# Altium project Kenworth_Overview_2.PrjPcb (part 3 of 4)

## Sheet Special_Equipment_Cabinet_Overview.SchDoc: <Document>
size Letter; Engineer: <Engineer>; Organization: UPEL; Address1: USU Power Electronics Lab; Address2: USTAR Building 620, RM 118; Address3: 1600 N 620 E; Address4: North Logan, UT 84341; DocumentNumber: 2; Revision: v1; SheetNumber: 2; SheetTotal: 16; ProjectName: <Project>
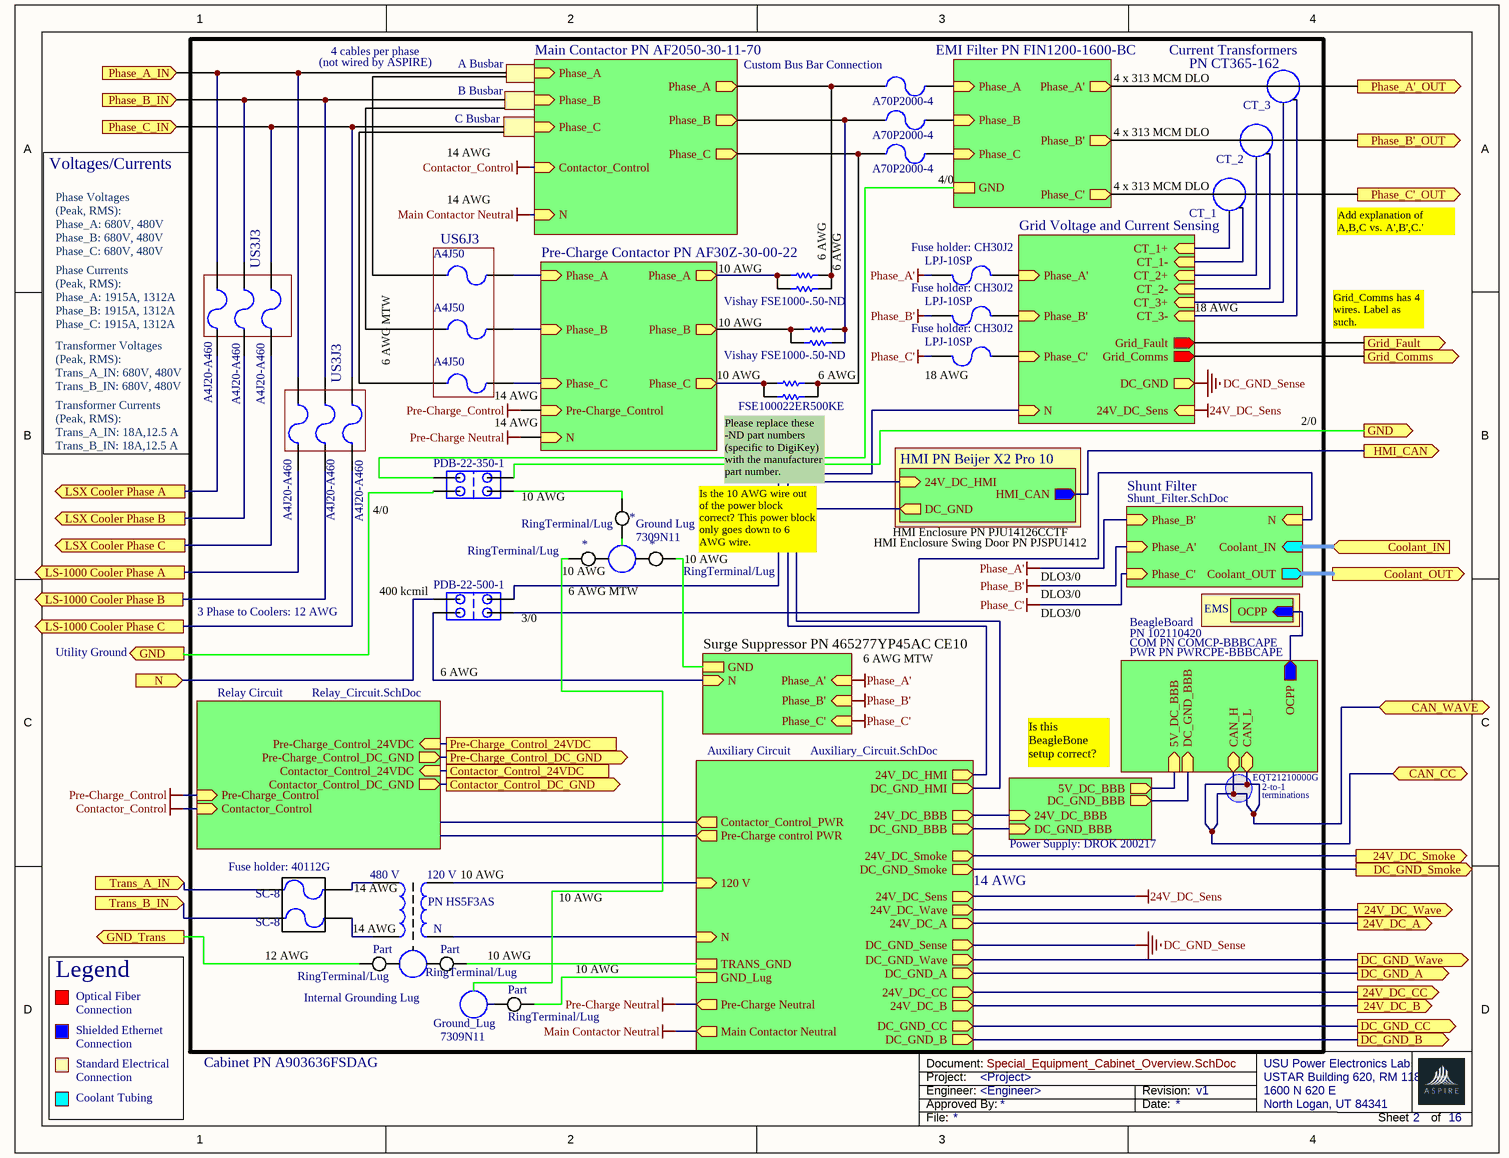
[diagram p9: Special_Equipment_Cabinet_Overview.SchDoc]

### Parts
(Parts that share a designator on the sheet are numbered #1, #2 ... from top to bottom, then left to right.)
7309N11#2  Ground_Lug_Three_Pin  (value not drawn)
7309N11#3  Ground_Lug_Three_Pin  (value not drawn)
7309N11#4  Ground_Lug
*#2  CT_3
*#3  CT_2
*#4  CT_1
*#5  RingTerminal/Lug
*#6  RingTerminal/Lug
*#7  RingTerminal/Lug
F64  A70P2000-4  [PIN-W2/E2.8]
F65  A70P2000-4  [PIN-W2/E2.8]
F66  A70P2000-4  [PIN-W2/E2.8]
F67  A4J50  [PIN-W2/E2.8]
F68  Fuse 2  [PIN-W2/E2.8]  (value not drawn)
F69  A4J50  [PIN-W2/E2.8]
F70  Fuse 2  [PIN-W2/E2.8]  (value not drawn)
F71  A4J50  [PIN-W2/E2.8]
F72  Fuse 2  [PIN-W2/E2.8]  (value not drawn)
F?#1  A4J20-A460  [PIN-W2/E2.8]
F?#2  A4J20-A460  [PIN-W2/E2.8]
F?#3  A4J20-A460  [PIN-W2/E2.8]
F?#4  A4J20-A460  [PIN-W2/E2.8]
F?#5  A4J20-A460  [PIN-W2/E2.8]
F?#6  A4J20-A460  [PIN-W2/E2.8]
FSE100022ER500KE  Res1  [AXIAL-0.3]  (value not drawn)
J16  PDB-22-350-1
J17  PDB-22-500-1
Part#1  RingTerminal/Lug
Part#2  RingTerminal/Lug
Part#3  RingTerminal/Lug
SC-8#1  Fuse 2  [PIN-W2/E2.8]  (value not drawn)
SC-8#2  Fuse 2  [PIN-W2/E2.8]  (value not drawn)
T1  PN HS5F3AS  [TRANS]
Vishay_FSE1  Res1  [AXIAL-0.3]  (value not drawn)
Vishay_FSE2  Res1  [AXIAL-0.3]  (value not drawn)
Vishay_FSE3  Res1  [AXIAL-0.3]  (value not drawn)
Vishay_FSE1000-.50-ND#1  Res1  [AXIAL-0.3]  (value not drawn)
Vishay_FSE1000-.50-ND#2  Res1  [AXIAL-0.3]  (value not drawn)

### Blocks framed on the sheet
US6J3: F67 F69 F71
US3J3: F?#1-F?#3
US3J3: F?#4-F?#6

### Sub-sheets
Auxiliary Circuit = Auxiliary_Circuit.SchDoc: 24V_DC_A (out), DC_GND_B (out), DC_GND_CC (out), 24V_DC_Wave (out), DC_GND_Wave (out), DC_GND_A (out), 24V_DC_CC (out), 24V_DC_B (out), 24V_DC_Sens (out), DC_GND_Sense (out), Pre-Charge Neutral (out), Main Contactor Neutral (out), 120 V (in), N (in), Contactor_Control_PWR (out), Pre-Charge control PWR (out), DC_GND_Smoke (out), 24V_DC_Smoke (out), TRANS_GND, GND_Lug, 24V_DC_HMI (out), DC_GND_HMI (out), 24V_DC_BBB (out), DC_GND_BBB (out)
BeagleBoard = File Name (file not in this document): OCPP (out), CAN_H (bidir), CAN_L (bidir), 5V_DC_BBB (in), DC_GND_BBB (in)
EMI Filter PN FIN1200-1600-BC = File Name (file not in this document): Phase_A (in), Phase_B (in), Phase_C (in), Phase_C' (out), Phase_B' (out), Phase_A' (out), GND
EMS = File Name (file not in this document): OCPP (in)
Grid Voltage and Current Sensing = File Name (file not in this document): Phase_A' (in), Phase_B' (in), Phase_C' (in), N (in), Grid_Comms (out), Grid_Fault (out), 24V_DC_Sens (in), CT_1+ (in), CT_3+ (in), CT_2+ (in), DC_GND (out), CT_1- (in), CT_2- (in), CT_3- (in)
HMI PN Beijer X2 Pro 10 = File Name (file not in this document): 24V_DC_HMI (in), HMI_CAN (out), DC_GND (out)
Main Contactor PN AF2050-30-11-70 = File Name (file not in this document): Phase_A (in), Phase_B (in), Phase_C (in), N (in), Contactor_Control (in), Phase_A (out), Phase_B (out), Phase_C (out)
Power Supply: DROK 200217 = File Name (file not in this document): 5V_DC_BBB (out), DC_GND_BBB (out), 24V_DC_BBB (in), DC_GND_BBB (in)
Pre-Charge Contactor PN AF30Z-30-00-22 = File Name (file not in this document): Phase_B (in), Phase_C (in), Phase_A (out), Phase_B (out), Phase_C (out), Phase_A (in), Pre-Charge_Control (in), N (in)
Relay Circuit = Relay_Circuit.SchDoc: Contactor_Control_24VDC (in), Pre-Charge_Control_DC_GND (out), Pre-Charge_Control (in), Pre-Charge_Control_24VDC (in), Contactor_Control (in), Contactor_Control_DC_GND (out)
Shunt Filter = Shunt_Filter.SchDoc: Phase_B' (in), Phase_A' (in), Phase_C' (in), N (in), Coolant_IN (in), Coolant_OUT (out)
Surge Suppressor PN 465277YP45AC CE10 = File Name (file not in this document): Phase_A' (in), Phase_B' (in), Phase_C' (in), N (in), GND

### Ports
24V_DC_A (out), 24V_DC_B (out), 24V_DC_CC (out), 24V_DC_Smoke (out), 24V_DC_Wave (out), CAN_CC (bidir), CAN_WAVE (bidir), Contactor_Control_24VDC, Contactor_Control_DC_GND (out), Coolant_IN (in), Coolant_OUT (out), DC_GND_A (out), DC_GND_B (out), DC_GND_CC (out), DC_GND_Smoke (out), DC_GND_Wave (out), GND (out), GND_Trans (out), Grid_Comms (out), Grid_Fault (out), HMI_CAN (out), LS-1000 Cooler Phase A (out), LS-1000 Cooler Phase B (out), LS-1000 Cooler Phase C (out), LSX Cooler Phase A (out), LSX Cooler Phase B (out), LSX Cooler Phase C (out), N (in), Phase_A'_OUT (out), Phase_A_IN (in), Phase_B'_OUT (out), Phase_B_IN (in), Phase_C'_OUT (out), Phase_C_IN (in), Pre-Charge_Control_24VDC, Pre-Charge_Control_DC_GND (out), Trans_A_IN (in), Trans_B_IN (in)

### Nets
24V_DC_Sens: sheet Grid Voltage and Current Sensing/24V_DC_Sens, sheet Auxiliary Circuit/24V_DC_Sens
Contactor_Control: sheet Main Contactor PN AF2050-30-11-70/Contactor_Control, sheet Relay Circuit/Contactor_Control
DC_GND_Sense: sheet Grid Voltage and Current Sensing/DC_GND, sheet Auxiliary Circuit/DC_GND_Sense
Main Contactor Neutral: sheet Main Contactor PN AF2050-30-11-70/N, sheet Auxiliary Circuit/Main Contactor Neutral
Phase_A': F68.2 ; sheet Surge Suppressor PN 465277YP45AC CE10/Phase_A', sheet Shunt Filter/Phase_B'
Phase_B': F70.2 ; sheet Surge Suppressor PN 465277YP45AC CE10/Phase_B', sheet Shunt Filter/Phase_A'
Phase_C': F72.2 ; sheet Surge Suppressor PN 465277YP45AC CE10/Phase_C', sheet Shunt Filter/Phase_C'
Pre-Charge Neutral: sheet Pre-Charge Contactor PN AF30Z-30-00-22/N, sheet Auxiliary Circuit/Pre-Charge Neutral
Pre-Charge_Control: sheet Pre-Charge Contactor PN AF30Z-30-00-22/Pre-Charge_Control, sheet Relay Circuit/Pre-Charge_Control
24V_DC_A: port 24V_DC_A, sheet Auxiliary Circuit/24V_DC_A
24V_DC_B: port 24V_DC_B, sheet Auxiliary Circuit/24V_DC_B
24V_DC_CC: port 24V_DC_CC, sheet Auxiliary Circuit/24V_DC_CC
24V_DC_HMI: sheet HMI PN Beijer X2 Pro 10/24V_DC_HMI, sheet Auxiliary Circuit/24V_DC_HMI
24V_DC_Smoke: port 24V_DC_Smoke, sheet Auxiliary Circuit/24V_DC_Smoke
24V_DC_Wave: port 24V_DC_Wave, sheet Auxiliary Circuit/24V_DC_Wave
120 V: T1.3 ; sheet Auxiliary Circuit/120 V
CAN_CC: port CAN_WAVE, port CAN_CC, sheet BeagleBoard/CAN_H, sheet BeagleBoard/CAN_L
Contactor_Control_24VDC: port Contactor_Control_24VDC, sheet Relay Circuit/Contactor_Control_24VDC
Contactor_Control_DC_GND: port Contactor_Control_DC_GND, sheet Relay Circuit/Contactor_Control_DC_GND
Coolant_IN: port Coolant_IN, sheet Shunt Filter/Coolant_IN
Coolant_OUT: port Coolant_OUT, sheet Shunt Filter/Coolant_OUT
DC_GND_A: port DC_GND_A, sheet Auxiliary Circuit/DC_GND_A
DC_GND_B: port DC_GND_B, sheet Auxiliary Circuit/DC_GND_B
DC_GND_CC: port DC_GND_CC, sheet Auxiliary Circuit/DC_GND_CC
DC_GND_HMI: sheet HMI PN Beijer X2 Pro 10/DC_GND, sheet Auxiliary Circuit/DC_GND_HMI
DC_GND_Smoke: port DC_GND_Smoke, sheet Auxiliary Circuit/DC_GND_Smoke
DC_GND_Wave: port DC_GND_Wave, sheet Auxiliary Circuit/DC_GND_Wave
GND: J16.2 J16.4 ; port GND
GND_Trans: Part#1.2_13 ; port GND_Trans
Grid_Comms: port Grid_Comms, sheet Grid Voltage and Current Sensing/Grid_Comms
Grid_Fault: port Grid_Fault, sheet Grid Voltage and Current Sensing/Grid_Fault
HMI_CAN: port HMI_CAN, sheet HMI PN Beijer X2 Pro 10/HMI_CAN
LS-1000 Cooler Phase A: F?#4.1 ; port LS-1000 Cooler Phase A
LS-1000 Cooler Phase B: F?#5.1 ; port LS-1000 Cooler Phase B
LS-1000 Cooler Phase C: F?#6.1 ; port LS-1000 Cooler Phase C
LSX Cooler Phase A: F?#1.1 ; port LSX Cooler Phase A
LSX Cooler Phase B: F?#2.1 ; port LSX Cooler Phase B
LSX Cooler Phase C: F?#3.1 ; port LSX Cooler Phase C
N: T1.4 ; sheet Auxiliary Circuit/N
N: J17.1 ; sheet Shunt Filter/N  [a separate net that carries the same name]
N: J17.4 ; port N  [a separate net that carries the same name]
Phase_A'_OUT: port Phase_A'_OUT, sheet EMI Filter PN FIN1200-1600-BC/Phase_A'
Phase_A_IN: F?#1.2 F?#4.2 ; port Phase_A_IN
Phase_B'_OUT: port Phase_B'_OUT, sheet EMI Filter PN FIN1200-1600-BC/Phase_B'
Phase_B_IN: F?#2.2 F?#5.2 ; port Phase_B_IN
Phase_C'_OUT: port Phase_C'_OUT, sheet EMI Filter PN FIN1200-1600-BC/Phase_C'
Phase_C_IN: F?#3.2 F?#6.2 ; port Phase_C_IN
Pre-Charge_Control_24VDC: port Pre-Charge_Control_24VDC, sheet Relay Circuit/Pre-Charge_Control_24VDC
Pre-Charge_Control_DC_GND: port Pre-Charge_Control_DC_GND, sheet Relay Circuit/Pre-Charge_Control_DC_GND
Trans_A_IN: SC-8#1.1 ; port Trans_A_IN
Trans_B_IN: SC-8#2.1 ; port Trans_B_IN
TRANS_GND: Part#2.2_12 ; sheet Auxiliary Circuit/TRANS_GND
Net7309N11#2_5: 7309N11#2.5 *#5.2_12
Net7309N11#2_5: 7309N11#2.5 *#7.2_13  [a separate net that carries the same name]
Net7309N11#2_5: 7309N11#2.5 *#6.2_12  [a separate net that carries the same name]
Net7309N11#3_5: 7309N11#3.5 Part#2.2_13
Net7309N11#3_5: 7309N11#3.5 Part#1.2_12  [a separate net that carries the same name]
Net7309N11#4_5: 7309N11#4.5 *#6.2_13
Net7309N11#4_5: 7309N11#4.5 Part#3.2_13  [a separate net that carries the same name]
Net*#2_4: *#2.4 ; sheet Grid Voltage and Current Sensing/CT_3+
Net*#2_4: *#2.4 ; sheet Grid Voltage and Current Sensing/CT_3-  [a separate net that carries the same name]
Net*#3_4: *#3.4 ; sheet Grid Voltage and Current Sensing/CT_2+
Net*#3_4: *#3.4 ; sheet Grid Voltage and Current Sensing/CT_2-  [a separate net that carries the same name]
Net*#4_4: *#4.4 ; sheet Grid Voltage and Current Sensing/CT_1+
Net*#4_4: *#4.4 ; sheet Grid Voltage and Current Sensing/CT_1-  [a separate net that carries the same name]
Net*#5_2_13: *#5.2_13 J16.1
Net*#7_2_12: *#7.2_12 ; sheet Surge Suppressor PN 465277YP45AC CE10/GND
NetF64_1: F64.1 Vishay_FSE1.2 Vishay_FSE1000-.50-ND#1.2 ; sheet Main Contactor PN AF2050-30-11-70/Phase_A
NetF64_2: F64.2 ; sheet EMI Filter PN FIN1200-1600-BC/Phase_A
NetF65_1: F65.1 Vishay_FSE2.2 Vishay_FSE1000-.50-ND#2.2 ; sheet Main Contactor PN AF2050-30-11-70/Phase_B
NetF65_2: F65.2 ; sheet EMI Filter PN FIN1200-1600-BC/Phase_B
NetF66_1: F66.1 FSE100022ER500KE.2 Vishay_FSE3.2 ; sheet Main Contactor PN AF2050-30-11-70/Phase_C
NetF66_2: F66.2 ; sheet EMI Filter PN FIN1200-1600-BC/Phase_C
NetF67_2: F67.2 ; sheet Pre-Charge Contactor PN AF30Z-30-00-22/Phase_A
NetF68_1: F68.1 ; sheet Grid Voltage and Current Sensing/Phase_A'
NetF69_2: F69.2 ; sheet Pre-Charge Contactor PN AF30Z-30-00-22/Phase_B
NetF70_1: F70.1 ; sheet Grid Voltage and Current Sensing/Phase_B'
NetF71_2: F71.2 ; sheet Pre-Charge Contactor PN AF30Z-30-00-22/Phase_C
NetF72_1: F72.1 ; sheet Grid Voltage and Current Sensing/Phase_C'
NetFSE100022ER500KE_1: FSE100022ER500KE.1 Vishay_FSE3.1 ; sheet Pre-Charge Contactor PN AF30Z-30-00-22/Phase_C
NetJ16_4: J16.4 ; sheet EMI Filter PN FIN1200-1600-BC/GND
NetJ17_2: J17.2 ; sheet Grid Voltage and Current Sensing/N
NetJ17_4: J17.4 ; sheet Surge Suppressor PN 465277YP45AC CE10/N
NetPart#3_2_12: Part#3.2_12 ; sheet Auxiliary Circuit/GND_Lug
NetSC-8#1_2: SC-8#1.2 T1.1
NetSC-8#2_2: SC-8#2.2 T1.2
NetVishay_FSE1_1: Vishay_FSE1.1 Vishay_FSE1000-.50-ND#1.1 ; sheet Pre-Charge Contactor PN AF30Z-30-00-22/Phase_A
NetVishay_FSE2_1: Vishay_FSE2.1 Vishay_FSE1000-.50-ND#2.1 ; sheet Pre-Charge Contactor PN AF30Z-30-00-22/Phase_B
(unnamed): sheet Auxiliary Circuit/24V_DC_BBB, sheet Power Supply: DROK 200217/24V_DC_BBB
(unnamed): sheet Auxiliary Circuit/DC_GND_BBB, sheet Power Supply: DROK 200217/DC_GND_BBB
(unnamed): sheet BeagleBoard/OCPP, sheet EMS/OCPP
(unnamed): sheet BeagleBoard/5V_DC_BBB, sheet Power Supply: DROK 200217/5V_DC_BBB
(unnamed): sheet BeagleBoard/DC_GND_BBB, sheet Power Supply: DROK 200217/DC_GND_BBB

Not connected (* = marked no-connect by the designer): F67 1; F69 1; F71 1

### Notes on the sheet
- (not wired by ASPIRE)
- 4 cables per phase
- B Busbar
- A Busbar
- (near F64) Custom Bus Bar Connection
- 4 x 313 MCM DLO
- (near *#2) Current Transformers
- (near *#2) PN CT365-162
- 14 AWG
- C Busbar
- (near *#3) 4 x 313 MCM DLO
- Voltages/Currents
- (near F66) 4/0
- (near *#4) 4 x 313 MCM DLO
- Add explanation of A,B,C vs. A',B',C.'
- Phase Voltages
  (Peak, RMS):
  Phase_A: 680V, 480V
  Phase_B: 680V, 480V
  Phase_C: 680V, 480V
- 10 AWG
- (near Vishay_FSE1000-.50-ND#1) 6 AWG
- 6 AWG
- (near F68) Fuse holder: CH30J2
- (near F68) LPJ-10SP
- (near F?#1) Phase Currents
  (Peak, RMS):
  Phase_A: 1915A, 1312A
  Phase_B: 1915A, 1312A
  Phase_C: 1915A, 1312A
- 6 AWG MTW
- (near F70) Fuse holder: CH30J2
- (near F70) LPJ-10SP
- (near F72) LPJ-10SP
- 18 AWG
- Grid_Comms has 4 wires. Label as such.
- (near F?#1) Transformer Voltages
  (Peak, RMS):
  Trans_A_IN: 680V, 480V
  Trans_B_IN: 680V, 480V
- (near F71) 14 AWG
- (near F72) 18 AWG
- 2/0
- Transformer Currents
  (Peak, RMS):
  Trans_A_IN: 18A,12.5 A
  Trans_B_IN: 18A,12.5 A
- (near J16) 10 AWG
- Please replace these -ND part numbers (specific to DigiKey) with the manufacturer part number.
- 4/0
- Ground Lug
- (near *#7) 10 AWG
- Is the 10 AWG wire out of the power block correct? This power block only goes down to 6 AWG wire.
- HMI Enclosure PN PJU14126CCTF
- HMI Enclosure Swing Door PN PJSPU1412
- 3 Phase to Coolers: 12 AWG
- (near J17) 400 kcmil
- (near J17) 3/0
- DLO3/0
- PN 102110420
- Utility Ground
- COM PN COMCP-BBBCAPE
- PWR PN PWRCPE-BBBCAPE
- Is this BeagleBone setup correct?
- EQT21210000G
- 2-to-1
- terminations
- (near SC-8#1) Fuse holder: 40112G
- (near T1) 14 AWG
- (near T1) 480 V
- (near T1) 120 V
- (near T1) 10 AWG
- (near SC-8#2) 12 AWG
- N
- Legend
- Optical Fiber
- Shielded Ethernet
- Connection
- Internal Grounding Lug
- Standard Electrical
- Coolant Tubing
- Cabinet PN A903636FSDAG
- Project:
- Engineer:
- Document:
- Approved By:
- Date:
- Revision:
- File:
- Sheet
- of

### Library data of the parts
*#2-*#4 = CT
F64-F72 F?#1-F?#6 SC-8#1 SC-8#2 = Fuse 2: Fuse; Published: 8-Jun-2000; LatestRevisionDate: 17-Jul-2002; LatestRevisionNote: Re-released for DXP Platform.; PackageReference: PIN-W2/E2.8; Publisher: Altium Limited; PackageDescription: Thru-Hole; 2 Leads
FSE100022ER500KE Vishay_FSE1 Vishay_FSE2 Vishay_FSE1000-.50-ND#1 Vishay_FSE1000-.50-ND#2 = Res1: Resistor; Value: 1K; Published: 8-Jun-2000; LatestRevisionDate: 17-Jul-2002; LatestRevisionNote: Re-released for DXP Platform.; PackageReference: AXIAL-0.3; Publisher: Altium Limited; PackageDescription: Axial Device, Thru-Hole; 2 Leads; 0.3 in Pin Spacing
J17 = PDB-22-350-1
T1 = Trans: Transformer; Published: 24-Mar-1999; LatestRevisionDate: 08-Jul-2005; LatestRevisionNote: Mech Layer 1 removed.; PackageReference: TRANS; Publisher: Altium Limited; PackageDescription: Transformer; 4 Leads
Vishay_FSE3 = Res1: Resistor; Value: 1K; MFN: FSE100022ER500KE; Published: 8-Jun-2000; LatestRevisionDate: 17-Jul-2002; LatestRevisionNote: Re-released for DXP Platform.; PackageReference: AXIAL-0.3; Publisher: Altium Limited; PackageDescription: Axial Device, Thru-Hole; 2 Leads; 0.3 in Pin Spacing

## Sheet Shunt_Filter.SchDoc: <Document>
size Letter; Engineer: <Engineer>; Organization: UPEL; Address1: USU Power Electronics Lab; Address2: USTAR Building 620, RM 118; Address3: 1600 N 620 E; Address4: North Logan, UT 84341; DocumentNumber: 3; Revision: v1; SheetNumber: 3; SheetTotal: 16; ProjectName: <Project>
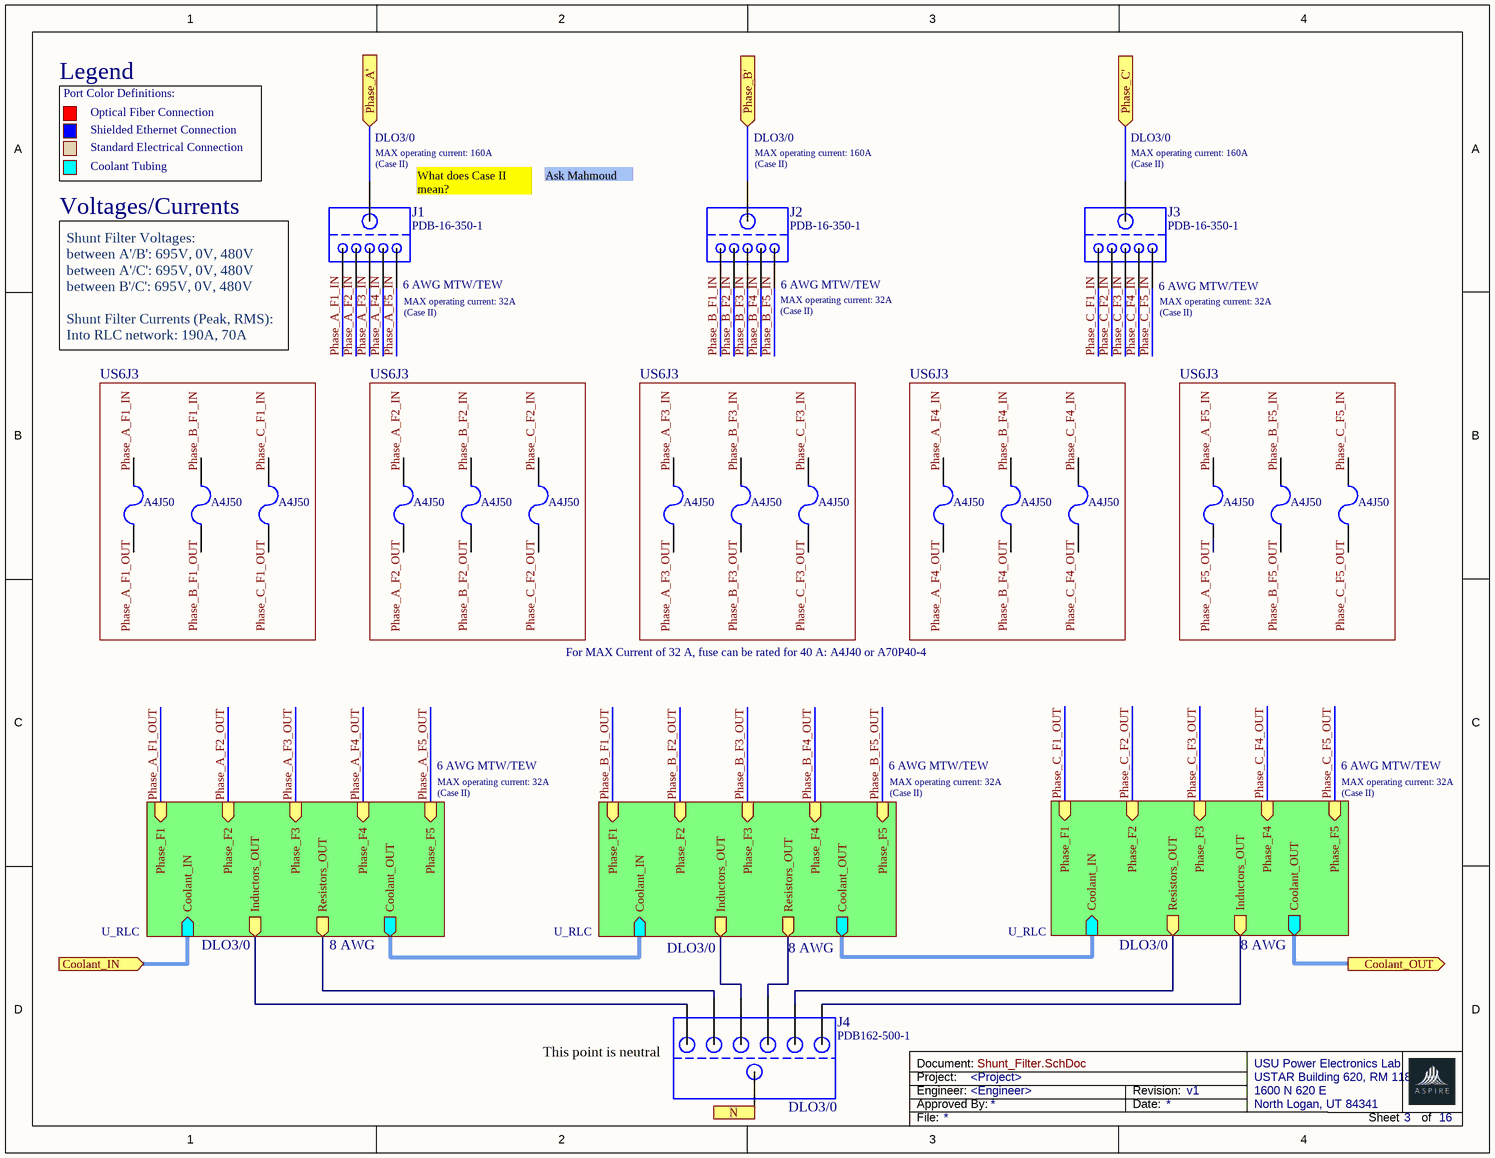
[diagram p10: Shunt_Filter.SchDoc]

### Parts
F1  A4J50  [PIN-W2/E2.8]
F2  A4J50  [PIN-W2/E2.8]
F3  A4J50  [PIN-W2/E2.8]
F4  A4J50  [PIN-W2/E2.8]
F5  A4J50  [PIN-W2/E2.8]
F7  A4J50  [PIN-W2/E2.8]
F8  A4J50  [PIN-W2/E2.8]
F9  A4J50  [PIN-W2/E2.8]
F10  A4J50  [PIN-W2/E2.8]
F11  A4J50  [PIN-W2/E2.8]
F12  A4J50  [PIN-W2/E2.8]
F13  A4J50  [PIN-W2/E2.8]
F14  A4J50  [PIN-W2/E2.8]
F15  A4J50  [PIN-W2/E2.8]
F16  A4J50  [PIN-W2/E2.8]
J1  PDB-16-350-1
J2  PDB-16-350-1
J3  PDB-16-350-1
J4  PDB162-500-1

### Blocks framed on the sheet
US6J3: F1-F3
US6J3: F4 F5 F7
US6J3: F8-F10
US6J3: F11-F13
US6J3: F14-F16

### Sub-sheets
U_RLC = RLC.SchDoc: Phase_F1 (in), Phase_F2 (in), Phase_F3 (in), Phase_F4 (in), Phase_F5 (in), Inductors_OUT (out), Resistors_OUT (out), Coolant_IN (in), Coolant_OUT (out)
U_RLC = RLC.SchDoc: Phase_F1 (in), Phase_F2 (in), Phase_F3 (in), Phase_F4 (in), Phase_F5 (in), Resistors_OUT (out), Inductors_OUT (out), Coolant_IN (in), Coolant_OUT (out)
U_RLC = RLC.SchDoc: Phase_F1 (in), Phase_F2 (in), Phase_F3 (in), Phase_F4 (in), Phase_F5 (in), Resistors_OUT (out), Inductors_OUT (out), Coolant_OUT (out), Coolant_IN (in)

### Ports
Coolant_IN (in), Coolant_OUT (out), N (in), Phase_A' (in), Phase_B' (in), Phase_C' (in)

### Nets
Phase_A': J2.0 ; port Phase_B'
Phase_B': J1.0 ; port Phase_A'
Phase_C': J3.0 ; port Phase_C'
Coolant_IN: port Coolant_IN, sheet U_RLC/Coolant_IN
Coolant_IN_U_RLC: sheet U_RLC/Coolant_OUT, sheet U_RLC/Coolant_IN
Coolant_IN_U_RLC: sheet U_RLC/Coolant_OUT, sheet U_RLC/Coolant_IN  [a separate net that carries the same name]
Coolant_OUT: port Coolant_OUT, sheet U_RLC/Coolant_OUT
Inductors_OUT: J4.0 ; sheet U_RLC/Inductors_OUT
Inductors_OUT: J4.0 ; sheet U_RLC/Inductors_OUT  [a separate net that carries the same name]
Inductors_OUT: J4.0 ; sheet U_RLC/Inductors_OUT  [a separate net that carries the same name]
N: J4.0 ; port N
Phase_A_F1_IN: J1.1
Phase_A_F2_IN: J1.2
Phase_A_F3_IN: J1.3
Phase_A_F4_IN: J1.4
Phase_A_F5_IN: J1.5
Phase_A_F5_OUT: F14.1 ; sheet U_RLC/Phase_F5
Phase_B_F1_IN: J2.1
Phase_B_F2_IN: J2.2
Phase_B_F3_IN: J2.3
Phase_B_F4_IN: J2.4
Phase_B_F5_IN: J2.5
Phase_C_F1_IN: J3.1
Phase_C_F2_IN: J3.2
Phase_C_F3_IN: J3.3
Phase_C_F4_IN: J3.4
Phase_C_F5_IN: J3.5
Resistors_OUT: J4.0 ; sheet U_RLC/Resistors_OUT
Resistors_OUT: J4.0 ; sheet U_RLC/Resistors_OUT  [a separate net that carries the same name]
Resistors_OUT: J4.0 ; sheet U_RLC/Resistors_OUT  [a separate net that carries the same name]

Not connected (* = marked no-connect by the designer): F1 1 2; F2 1 2; F3 1 2; F4 1 2; F5 1 2; F7 1 2; F8 1 2; F9 1 2; F10 1 2; F11 1 2; F12 1 2; F13 1 2; F14 2; F15 1 2; F16 1 2

### Notes on the sheet
- Legend
- Port Color Definitions:
- Optical Fiber Connection
- Shielded Ethernet Connection
- Standard Electrical Connection
- (near J1) MAX operating current: 160A
  (Case II)
- DLO3/0
- (near J2) MAX operating current: 160A
  (Case II)
- (near J3) MAX operating current: 160A
  (Case II)
- Voltages/Currents
- Coolant Tubing
- (near J1) What does Case II mean?
- Ask Mahmoud
- (near J1) 6 AWG MTW/TEW
- (near J2) 6 AWG MTW/TEW
- (near J3) 6 AWG MTW/TEW
- Shunt Filter Voltages:
  between A'/B': 695V, 0V, 480V
  between A'/C': 695V, 0V, 480V
  between B'/C': 695V, 0V, 480V
  Shunt Filter Currents (Peak, RMS):
  Into RLC network: 190A, 70A
- (near J1) MAX operating current: 32A
  (Case II)
- (near J2) MAX operating current: 32A
  (Case II)
- (near J3) MAX operating current: 32A
  (Case II)
- For MAX Current of 32 A, fuse can be rated for 40 A: A4J40 or A70P40-4
- 6 AWG MTW/TEW
- MAX operating current: 32A
  (Case II)
- 8 AWG
- (near J4) This point is neutral
- (near J4) DLO3/0
- Labels drawn without touching a wire or pin: Phase_A_F1_IN, Phase_A_F1_OUT, Phase_A_F2_IN, Phase_A_F2_OUT, Phase_A_F3_IN, Phase_A_F3_OUT, Phase_A_F4_IN, Phase_A_F4_OUT, Phase_A_F5_IN, Phase_B_F1_IN, Phase_B_F1_OUT, Phase_B_F2_IN, Phase_B_F2_OUT, Phase_B_F3_IN, Phase_B_F3_OUT, Phase_B_F4_IN, Phase_B_F4_OUT, Phase_B_F5_IN, Phase_B_F5_OUT, Phase_C_F1_IN, Phase_C_F1_OUT, Phase_C_F2_IN, Phase_C_F2_OUT, Phase_C_F3_IN, Phase_C_F3_OUT, Phase_C_F4_IN, Phase_C_F4_OUT, Phase_C_F5_IN, Phase_C_F5_OUT
- Project:
- Engineer:
- Document:
- Approved By:
- Date:
- Revision:
- File:
- Sheet
- of

### Library data of the parts
F1-F5 F7-F16 = Fuse 2: Fuse; Published: 8-Jun-2000; LatestRevisionDate: 17-Jul-2002; LatestRevisionNote: Re-released for DXP Platform.; PackageReference: PIN-W2/E2.8; Publisher: Altium Limited; PackageDescription: Thru-Hole; 2 Leads

## Sheet RLC.SchDoc: <Document>
size Letter; Engineer: <Engineer>; Organization: UPEL; Address1: USU Power Electronics Lab; Address2: USTAR Building 620, RM 118; Address3: 1600 N 620 E; Address4: North Logan, UT 84341; DocumentNumber: 4; Revision: v1; SheetNumber: 4; SheetTotal: 16; ProjectName: <Project>
Used 3 times, as channels Special Equipment Cabinet/Shunt Filter/U_RLC, Special Equipment Cabinet/Shunt Filter/U_RLC, Special Equipment Cabinet/Shunt Filter/U_RLC. Parts and nets are listed once, with the designators drawn on the sheet.
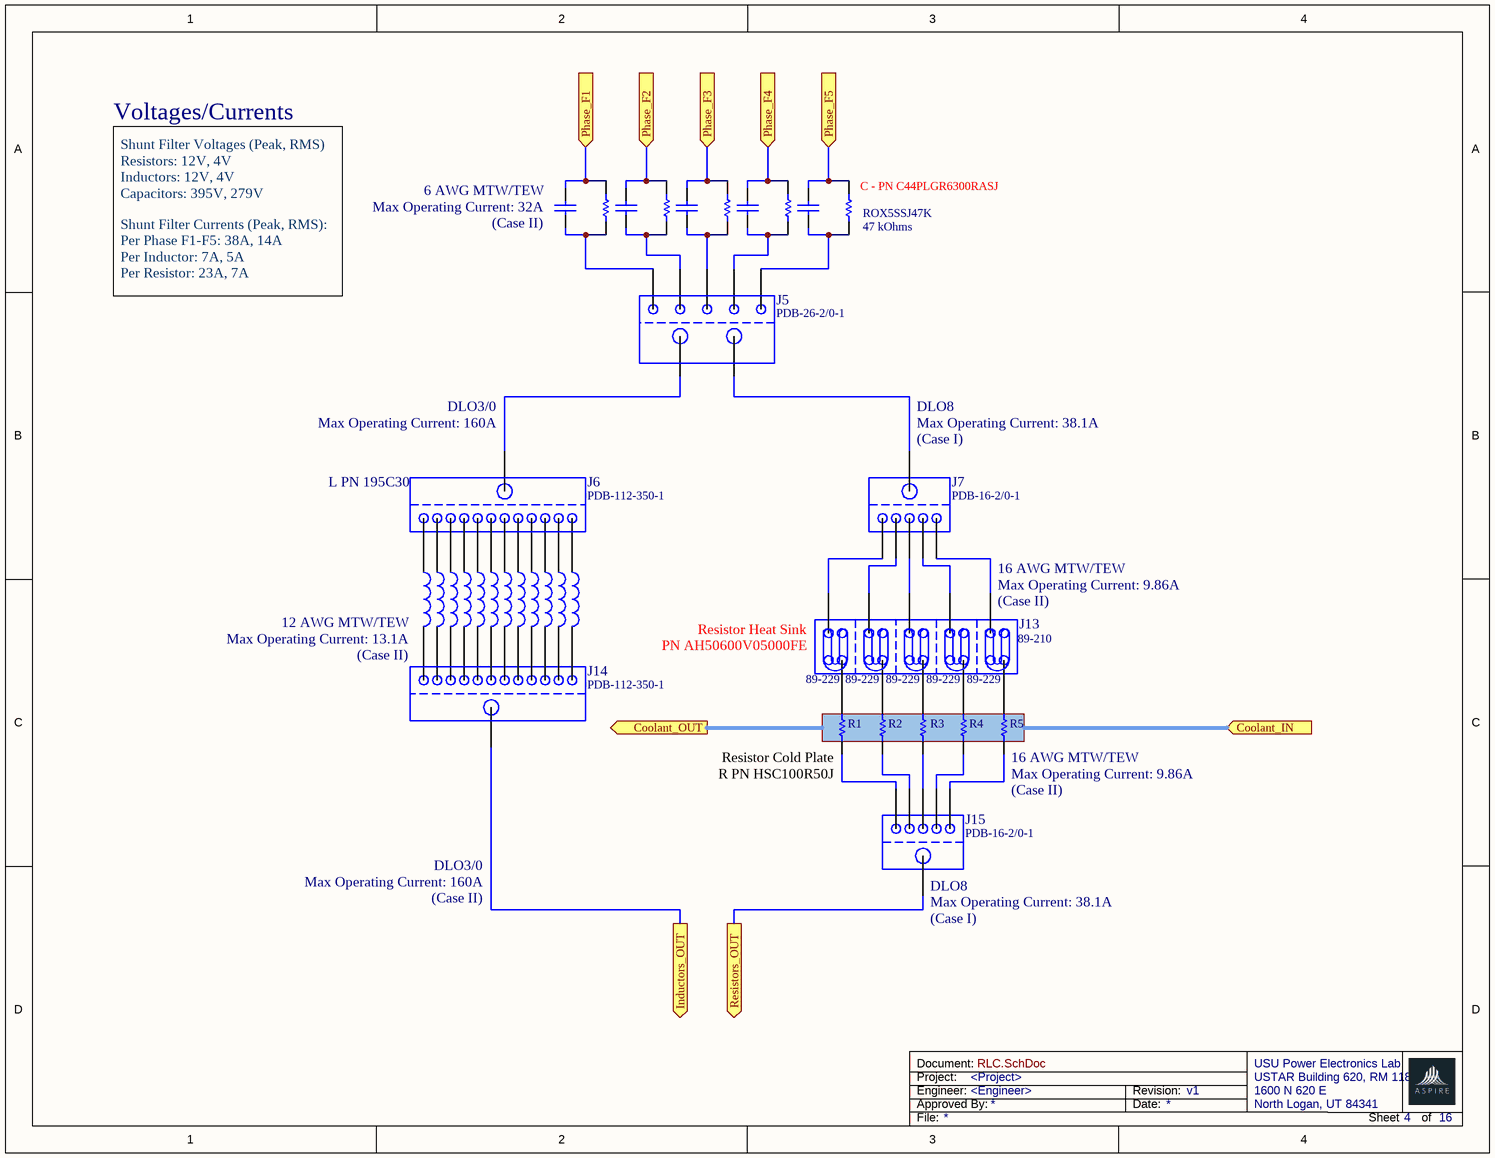
[diagram p11: RLC.SchDoc]

### Parts
(Parts that share a designator on the sheet are numbered #1, #2 ... from top to bottom, then left to right.)
C1  Cap  [RAD-0.3]  (value not drawn)
C2  Cap  [RAD-0.3]  (value not drawn)
C3  Cap  [RAD-0.3]  (value not drawn)
C4  Cap  [RAD-0.3]  (value not drawn)
C5  Cap  [RAD-0.3]  (value not drawn)
J5  PDB-26-2/0-1
J6  PDB-112-350-1
J7  PDB-16-2/0-1
J8  89-229
J9  89-229
J10  89-229
J11  89-229
J12  89-229
J13  89-210
J14  PDB-112-350-1
J15  PDB-16-2/0-1
L3  Inductor  [0402-A]  (value not drawn)
L4  Inductor  [0402-A]  (value not drawn)
L5  Inductor  [0402-A]  (value not drawn)
L6  Inductor  [0402-A]  (value not drawn)
L7  Inductor  [0402-A]  (value not drawn)
L8  Inductor  [0402-A]  (value not drawn)
L9  Inductor  [0402-A]  (value not drawn)
L10  Inductor  [0402-A]  (value not drawn)
L11  Inductor  [0402-A]  (value not drawn)
L12  Inductor  [0402-A]  (value not drawn)
L13  Inductor  [0402-A]  (value not drawn)
L14  Inductor  [0402-A]  (value not drawn)
R1  {Rsh}  [AXIAL-0.3]  (value not drawn)
R2  {Rsh}  [AXIAL-0.3]  (value not drawn)
R3  {Rsh}  [AXIAL-0.3]  (value not drawn)
R4  {Rsh}  [AXIAL-0.3]  (value not drawn)
R5  {Rsh}  [AXIAL-0.3]  (value not drawn)
ROX5SSJ47K  47 kOhms
ROX?#1  47 kOhms  (value not drawn)
ROX?#2  47 kOhms  (value not drawn)
ROX?#3  47 kOhms  (value not drawn)
ROX?#4  47 kOhms  (value not drawn)

### Ports
Coolant_IN (in), Coolant_OUT (out), Inductors_OUT (out), Phase_F1 (in), Phase_F2 (in), Phase_F3 (in), Phase_F4 (in), Phase_F5 (in), Resistors_OUT (out)

### Nets
Inductors_OUT: J14.0 ; port Inductors_OUT
Phase_F1: C1.2 ROX?#1.2 ; port Phase_F1
Phase_F2: C2.2 ROX?#2.2 ; port Phase_F2
Phase_F3: C3.2 ROX?#3.2 ; port Phase_F3
Phase_F4: C4.2 ROX?#4.2 ; port Phase_F4
Phase_F5: C5.2 ROX5SSJ47K.2 ; port Phase_F5
Resistors_OUT: J15.0 ; port Resistors_OUT
NetC1_1: C1.1 J5.5 ROX?#1.1
NetC2_1: C2.1 J5.4 ROX?#2.1
NetC3_1: C3.1 J5.3 ROX?#3.1
NetC4_1: C4.1 J5.2 ROX?#4.1
NetC5_1: C5.1 J5.1 ROX5SSJ47K.1
NetJ5_0: J5.0 J6.0
NetJ5_0: J5.0 J7.0  [a separate net that carries the same name]
NetJ6_1: J6.1 L3.1
NetJ6_1: J6.1 L5.1  [a separate net that carries the same name]
NetJ6_1: J6.1 L14.1  [a separate net that carries the same name]
NetJ6_2: J6.2 L4.1
NetJ6_2: J6.2 L6.1  [a separate net that carries the same name]
NetJ6_2: J6.2 L13.1  [a separate net that carries the same name]
NetJ6_3: J6.3 L7.1
NetJ6_3: J6.3 L10.1  [a separate net that carries the same name]
NetJ6_4: J6.4 L8.1
NetJ6_4: J6.4 L11.1  [a separate net that carries the same name]
NetJ6_5: J6.5 L9.1
NetJ6_5: J6.5 L12.1  [a separate net that carries the same name]
NetJ7_1: J7.1 J13.6
NetJ7_2: J7.2 J13.7
NetJ7_3: J7.3 J13.8
NetJ7_4: J7.4 J13.9
NetJ7_5: J7.5 J13.10
NetJ13_11: J13.11 R1.2
NetJ13_12: J13.12 R2.2
NetJ13_13: J13.13 R3.2
NetJ13_14: J13.14 R4.2
NetJ13_15: J13.15 R5.2
NetJ14_1: J14.1 L7.2
NetJ14_1: J14.1 L10.2  [a separate net that carries the same name]
NetJ14_1: J14.1 L12.2  [a separate net that carries the same name]
NetJ14_2: J14.2 L6.2
NetJ14_2: J14.2 L11.2  [a separate net that carries the same name]
NetJ14_2: J14.2 L13.2  [a separate net that carries the same name]
NetJ14_3: J14.3 L5.2
NetJ14_3: J14.3 L14.2  [a separate net that carries the same name]
NetJ14_4: J14.4 L4.2
NetJ14_4: J14.4 L9.2  [a separate net that carries the same name]
NetJ14_5: J14.5 L3.2
NetJ14_5: J14.5 L8.2  [a separate net that carries the same name]
NetJ15_1: J15.1 R5.1
NetJ15_2: J15.2 R4.1
NetJ15_3: J15.3 R3.1
NetJ15_4: J15.4 R2.1
NetJ15_5: J15.5 R1.1

### Channels
Special Equipment Cabinet/Shunt Filter/U_RLC: designators C1=C1_Special_Equipment_Cabinet_Shunt_Filter_U_RLC#1 C2=C2_Special_Equipment_Cabinet_Shunt_Filter_U_RLC#1 C3=C3_Special_Equipment_Cabinet_Shunt_Filter_U_RLC#1 C4=C4_Special_Equipment_Cabinet_Shunt_Filter_U_RLC#1 C5=C5_Special_Equipment_Cabinet_Shunt_Filter_U_RLC#1 J5=J5_Special_Equipment_Cabinet_Shunt_Filter_U_RLC#1 J6=J6_Special_Equipment_Cabinet_Shunt_Filter_U_RLC#1 J7=J7_Special_Equipment_Cabinet_Shunt_Filter_U_RLC#1 J8=J8_Special_Equipment_Cabinet_Shunt_Filter_U_RLC#1 J9=J9_Special_Equipment_Cabinet_Shunt_Filter_U_RLC#1 J10=J10_Special_Equipment_Cabinet_Shunt_Filter_U_RLC#1 J11=J11_Special_Equipment_Cabinet_Shunt_Filter_U_RLC#1 J12=J12_Special_Equipment_Cabinet_Shunt_Filter_U_RLC#1 J13=J13_Special_Equipment_Cabinet_Shunt_Filter_U_RLC#1 J14=J14_Special_Equipment_Cabinet_Shunt_Filter_U_RLC#1 J15=J15_Special_Equipment_Cabinet_Shunt_Filter_U_RLC#1 L3=L3_Special_Equipment_Cabinet_Shunt_Filter_U_RLC#1 L4=L4_Special_Equipment_Cabinet_Shunt_Filter_U_RLC#1 L5=L5_Special_Equipment_Cabinet_Shunt_Filter_U_RLC#1 L6=L6_Special_Equipment_Cabinet_Shunt_Filter_U_RLC#1 L7=L7_Special_Equipment_Cabinet_Shunt_Filter_U_RLC#1 L8=L8_Special_Equipment_Cabinet_Shunt_Filter_U_RLC#1 L9=L9_Special_Equipment_Cabinet_Shunt_Filter_U_RLC#1 L10=L10_Special_Equipment_Cabinet_Shunt_Filter_U_RLC#1 L11=L11_Special_Equipment_Cabinet_Shunt_Filter_U_RLC#1 L12=L12_Special_Equipment_Cabinet_Shunt_Filter_U_RLC#1 L13=L13_Special_Equipment_Cabinet_Shunt_Filter_U_RLC#1 L14=L14_Special_Equipment_Cabinet_Shunt_Filter_U_RLC#1 R1=R1_Special_Equipment_Cabinet_Shunt_Filter_U_RLC#1 R2=R2_Special_Equipment_Cabinet_Shunt_Filter_U_RLC#1 R3=R3_Special_Equipment_Cabinet_Shunt_Filter_U_RLC#1 R4=R4_Special_Equipment_Cabinet_Shunt_Filter_U_RLC#1 R5=R5_Special_Equipment_Cabinet_Shunt_Filter_U_RLC#1 ROX5SSJ47K=ROX5SSJ47K_Special_Equipment_Cabinet_Shunt_Filter_U_RLC#1 ROX?=ROX?_Special_Equipment_Cabinet_Shunt_Filter_U_RLC#3 ROX?=ROX?_Special_Equipment_Cabinet_Shunt_Filter_U_RLC#1 ROX?=ROX?_Special_Equipment_Cabinet_Shunt_Filter_U_RLC#2 ROX?=ROX?_Special_Equipment_Cabinet_Shunt_Filter_U_RLC#4; ports Coolant_IN=Coolant_IN Coolant_OUT=Coolant_IN_U_RLC Inductors_OUT=Inductors_OUT Phase_F1=Phase_A_F1_OUT Phase_F2=Phase_A_F2_OUT Phase_F3=Phase_A_F3_OUT Phase_F4=Phase_A_F4_OUT Phase_F5=Phase_A_F5_OUT Resistors_OUT=Resistors_OUT
Special Equipment Cabinet/Shunt Filter/U_RLC: designators C1=C1_Special_Equipment_Cabinet_Shunt_Filter_U_RLC#2 C2=C2_Special_Equipment_Cabinet_Shunt_Filter_U_RLC#2 C3=C3_Special_Equipment_Cabinet_Shunt_Filter_U_RLC#2 C4=C4_Special_Equipment_Cabinet_Shunt_Filter_U_RLC#2 C5=C5_Special_Equipment_Cabinet_Shunt_Filter_U_RLC#2 J5=J5_Special_Equipment_Cabinet_Shunt_Filter_U_RLC#2 J6=J6_Special_Equipment_Cabinet_Shunt_Filter_U_RLC#2 J7=J7_Special_Equipment_Cabinet_Shunt_Filter_U_RLC#2 J8=J8_Special_Equipment_Cabinet_Shunt_Filter_U_RLC#2 J9=J9_Special_Equipment_Cabinet_Shunt_Filter_U_RLC#2 J10=J10_Special_Equipment_Cabinet_Shunt_Filter_U_RLC#2 J11=J11_Special_Equipment_Cabinet_Shunt_Filter_U_RLC#2 J12=J12_Special_Equipment_Cabinet_Shunt_Filter_U_RLC#2 J13=J13_Special_Equipment_Cabinet_Shunt_Filter_U_RLC#2 J14=J14_Special_Equipment_Cabinet_Shunt_Filter_U_RLC#2 J15=J15_Special_Equipment_Cabinet_Shunt_Filter_U_RLC#2 L3=L3_Special_Equipment_Cabinet_Shunt_Filter_U_RLC#2 L4=L4_Special_Equipment_Cabinet_Shunt_Filter_U_RLC#2 L5=L5_Special_Equipment_Cabinet_Shunt_Filter_U_RLC#2 L6=L6_Special_Equipment_Cabinet_Shunt_Filter_U_RLC#2 L7=L7_Special_Equipment_Cabinet_Shunt_Filter_U_RLC#2 L8=L8_Special_Equipment_Cabinet_Shunt_Filter_U_RLC#2 L9=L9_Special_Equipment_Cabinet_Shunt_Filter_U_RLC#2 L10=L10_Special_Equipment_Cabinet_Shunt_Filter_U_RLC#2 L11=L11_Special_Equipment_Cabinet_Shunt_Filter_U_RLC#2 L12=L12_Special_Equipment_Cabinet_Shunt_Filter_U_RLC#2 L13=L13_Special_Equipment_Cabinet_Shunt_Filter_U_RLC#2 L14=L14_Special_Equipment_Cabinet_Shunt_Filter_U_RLC#2 R1=R1_Special_Equipment_Cabinet_Shunt_Filter_U_RLC#2 R2=R2_Special_Equipment_Cabinet_Shunt_Filter_U_RLC#2 R3=R3_Special_Equipment_Cabinet_Shunt_Filter_U_RLC#2 R4=R4_Special_Equipment_Cabinet_Shunt_Filter_U_RLC#2 R5=R5_Special_Equipment_Cabinet_Shunt_Filter_U_RLC#2 ROX5SSJ47K=ROX5SSJ47K_Special_Equipment_Cabinet_Shunt_Filter_U_RLC#2 ROX?=ROX?_Special_Equipment_Cabinet_Shunt_Filter_U_RLC#7 ROX?=ROX?_Special_Equipment_Cabinet_Shunt_Filter_U_RLC#5 ROX?=ROX?_Special_Equipment_Cabinet_Shunt_Filter_U_RLC#6 ROX?=ROX?_Special_Equipment_Cabinet_Shunt_Filter_U_RLC#8; ports Coolant_IN=Coolant_IN_U_RLC Coolant_OUT=Coolant_IN_U_RLC Inductors_OUT=Inductors_OUT Phase_F1=Phase_B_F1_OUT Phase_F2=Phase_B_F2_OUT Phase_F3=Phase_B_F3_OUT Phase_F4=Phase_B_F4_OUT Phase_F5=Phase_B_F5_OUT Resistors_OUT=Resistors_OUT
Special Equipment Cabinet/Shunt Filter/U_RLC: designators C1=C1_Special_Equipment_Cabinet_Shunt_Filter_U_RLC#3 C2=C2_Special_Equipment_Cabinet_Shunt_Filter_U_RLC#3 C3=C3_Special_Equipment_Cabinet_Shunt_Filter_U_RLC#3 C4=C4_Special_Equipment_Cabinet_Shunt_Filter_U_RLC#3 C5=C5_Special_Equipment_Cabinet_Shunt_Filter_U_RLC#3 J5=J5_Special_Equipment_Cabinet_Shunt_Filter_U_RLC#3 J6=J6_Special_Equipment_Cabinet_Shunt_Filter_U_RLC#3 J7=J7_Special_Equipment_Cabinet_Shunt_Filter_U_RLC#3 J8=J8_Special_Equipment_Cabinet_Shunt_Filter_U_RLC#3 J9=J9_Special_Equipment_Cabinet_Shunt_Filter_U_RLC#3 J10=J10_Special_Equipment_Cabinet_Shunt_Filter_U_RLC#3 J11=J11_Special_Equipment_Cabinet_Shunt_Filter_U_RLC#3 J12=J12_Special_Equipment_Cabinet_Shunt_Filter_U_RLC#3 J13=J13_Special_Equipment_Cabinet_Shunt_Filter_U_RLC#3 J14=J14_Special_Equipment_Cabinet_Shunt_Filter_U_RLC#3 J15=J15_Special_Equipment_Cabinet_Shunt_Filter_U_RLC#3 L3=L3_Special_Equipment_Cabinet_Shunt_Filter_U_RLC#3 L4=L4_Special_Equipment_Cabinet_Shunt_Filter_U_RLC#3 L5=L5_Special_Equipment_Cabinet_Shunt_Filter_U_RLC#3 L6=L6_Special_Equipment_Cabinet_Shunt_Filter_U_RLC#3 L7=L7_Special_Equipment_Cabinet_Shunt_Filter_U_RLC#3 L8=L8_Special_Equipment_Cabinet_Shunt_Filter_U_RLC#3 L9=L9_Special_Equipment_Cabinet_Shunt_Filter_U_RLC#3 L10=L10_Special_Equipment_Cabinet_Shunt_Filter_U_RLC#3 L11=L11_Special_Equipment_Cabinet_Shunt_Filter_U_RLC#3 L12=L12_Special_Equipment_Cabinet_Shunt_Filter_U_RLC#3 L13=L13_Special_Equipment_Cabinet_Shunt_Filter_U_RLC#3 L14=L14_Special_Equipment_Cabinet_Shunt_Filter_U_RLC#3 R1=R1_Special_Equipment_Cabinet_Shunt_Filter_U_RLC#3 R2=R2_Special_Equipment_Cabinet_Shunt_Filter_U_RLC#3 R3=R3_Special_Equipment_Cabinet_Shunt_Filter_U_RLC#3 R4=R4_Special_Equipment_Cabinet_Shunt_Filter_U_RLC#3 R5=R5_Special_Equipment_Cabinet_Shunt_Filter_U_RLC#3 ROX5SSJ47K=ROX5SSJ47K_Special_Equipment_Cabinet_Shunt_Filter_U_RLC#3 ROX?=ROX?_Special_Equipment_Cabinet_Shunt_Filter_U_RLC#11 ROX?=ROX?_Special_Equipment_Cabinet_Shunt_Filter_U_RLC#9 ROX?=ROX?_Special_Equipment_Cabinet_Shunt_Filter_U_RLC#10 ROX?=ROX?_Special_Equipment_Cabinet_Shunt_Filter_U_RLC#12; ports Coolant_IN=Coolant_IN_U_RLC Coolant_OUT=Coolant_OUT Inductors_OUT=Inductors_OUT Phase_F1=Phase_C_F1_OUT Phase_F2=Phase_C_F2_OUT Phase_F3=Phase_C_F3_OUT Phase_F4=Phase_C_F4_OUT Phase_F5=Phase_C_F5_OUT Resistors_OUT=Resistors_OUT

### Notes on the sheet
- Voltages/Currents
- Shunt Filter Voltages (Peak, RMS)
  Resistors: 12V, 4V
  Inductors: 12V, 4V
  Capacitors: 395V, 279V
- (near C1) 6 AWG MTW/TEW
  Max Operating Current: 32A
  (Case II)
- (near ROX5SSJ47K) C - PN C44PLGR6300RASJ
- Shunt Filter Currents (Peak, RMS):
  Per Phase F1-F5: 38A, 14A
  Per Inductor: 7A, 5A
  Per Resistor: 23A, 7A
- DLO3/0
  Max Operating Current: 160A
- (near J6) L PN 195C30
- (near J7) DLO8
  Max Operating Current: 38.1A
  (Case I)
- 16 AWG MTW/TEW
  Max Operating Current: 9.86A
  (Case II)
- 12 AWG MTW/TEW
  Max Operating Current: 13.1A
  (Case II)
- (near J13) Resistor Heat Sink
  PN AH50600V05000FE
- (near R1) Resistor Cold Plate
  R PN HSC100R50J
- (near R5) 16 AWG MTW/TEW
  Max Operating Current: 9.86A
  (Case II)
- DLO3/0
  Max Operating Current: 160A
  (Case II)
- (near J15) DLO8
  Max Operating Current: 38.1A
  (Case I)
- Project:
- Engineer:
- Document:
- Approved By:
- Date:
- Revision:
- File:
- Sheet
- of

### Library data of the parts
C1-C5 = Cap: Capacitor; Value: {Csh}; Published: 8-Jun-2000; LatestRevisionDate: 17-Jul-2002; LatestRevisionNote: Re-released for DXP Platform.; PackageReference: RAD-0.3; Publisher: Altium Limited; PackageDescription: Radial Cap, Thru-Hole; 2 Leads; 0.3 in Pin Spacing
L3-L14 = Inductor: Code_IEC: 1005; Value: {Lsh}; Published: 8-Jun-2000; LatestRevisionDate: 29-May-2009; LatestRevisionNote: IPC-7351 Footprint Added.; PackageReference: 0402-A; Publisher: Altium Limited; PackageDescription: Chip Inductor; Code_JEITA: 0402
R1-R5 = Res1: Resistor; Value: 1K; Published: 8-Jun-2000; LatestRevisionDate: 17-Jul-2002; LatestRevisionNote: Re-released for DXP Platform.; PackageReference: AXIAL-0.3; Publisher: Altium Limited; PackageDescription: Axial Device, Thru-Hole; 2 Leads; 0.3 in Pin Spacing
ROX5SSJ47K ROX?#1-ROX?#4 = Resistor: TC1: 0; SimulationGenericComponent: True; Value: 1K; TC2: 0

## Sheet Auxiliary_Circuit.SchDoc: <Document>
size Letter; Engineer: <Engineer>; Organization: UPEL; Address1: USU Power Electronics Lab; Address2: USTAR Building 620, RM 118; Address3: 1600 N 620 E; Address4: North Logan, UT 84341; DocumentNumber: 2; Revision: v1; SheetNumber: 2; SheetTotal: 16; ProjectName: <Project>
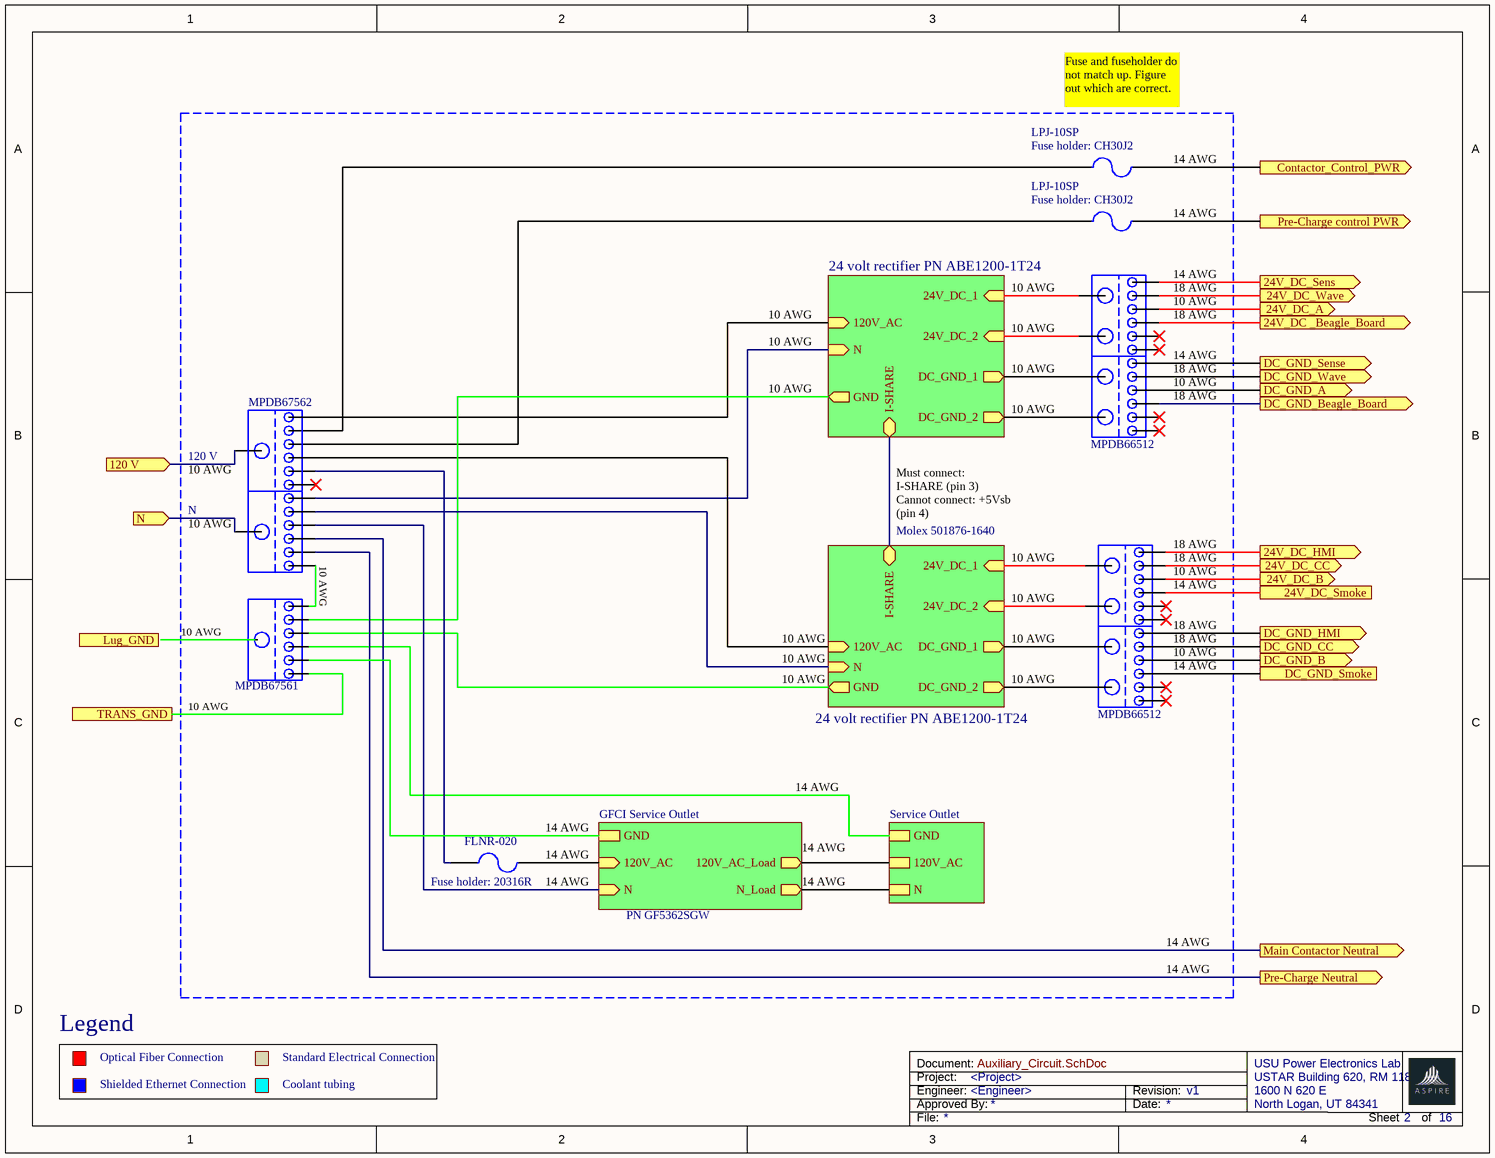
[diagram p12: Auxiliary_Circuit.SchDoc]

### Parts
(Parts that share a designator on the sheet are numbered #1, #2 ... from top to bottom, then left to right.)
*#8  MPDB67561
F73  LPJ-10SP  [PIN-W2/E2.8]
F74  LPJ-10SP  [PIN-W2/E2.8]
FLNR-020  Fuse 2  [PIN-W2/E2.8]  (value not drawn)
J18  MPDB66512
J19  MPDB67562
J20  MPDB66512

### Sub-sheets
24 volt rectifier PN ABE1200-1T24 = File Name (file not in this document): 120V_AC (in), N (in), 24V_DC_1 (in), DC_GND_1 (out), 24V_DC_2 (in), DC_GND_2 (out), GND (out), I-SHARE (bidir)
24 volt rectifier PN ABE1200-1T24 = File Name (file not in this document): 120V_AC (in), N (in), 24V_DC_1 (in), DC_GND_1 (out), 24V_DC_2 (in), DC_GND_2 (out), GND (out), I-SHARE (bidir)
GFCI Service Outlet = File Name (file not in this document): GND, 120V_AC (in), N (in), 120V_AC_Load (out), N_Load (out)
Service Outlet = File Name (file not in this document): GND, 120V_AC, N

### Ports
24V_DC _Beagle_Board (out), 24V_DC_A (out), 24V_DC_B (out), 24V_DC_CC (out), 24V_DC_HMI (out), 24V_DC_Sens (out), 24V_DC_Smoke, 24V_DC_Wave (out), 120 V (in), Contactor_Control_PWR (out), DC_GND_A (out), DC_GND_B (out), DC_GND_Beagle_Board (out), DC_GND_CC (out), DC_GND_HMI (out), DC_GND_Sense (out), DC_GND_Smoke, DC_GND_Wave (out), Lug_GND, Main Contactor Neutral (out), N (in), Pre-Charge control PWR (out), Pre-Charge Neutral (out), TRANS_GND

### Nets
24V_DC_Sens: J18.2 ; port 24V_DC_Sens
DC_GND_Sense: J18.2 ; port DC_GND_Sense
Main Contactor Neutral: J19.1 ; port Main Contactor Neutral
Pre-Charge Neutral: J19.1 ; port Pre-Charge Neutral
24V_DC _Beagle_Board: J18.1 ; port 24V_DC _Beagle_Board
24V_DC_A: J18.2 ; port 24V_DC_A
24V_DC_B: J20.2 ; port 24V_DC_B
24V_DC_CC: J20.1 ; port 24V_DC_CC
24V_DC_HMI: J20.2 ; port 24V_DC_HMI
24V_DC_Smoke: J20.1 ; port 24V_DC_Smoke
24V_DC_Wave: J18.1 ; port 24V_DC_Wave
120 V: J19.0 ; port 120 V
Contactor_Control_PWR: F73.2 ; port Contactor_Control_PWR
DC_GND_A: J18.2 ; port DC_GND_A
DC_GND_B: J20.2 ; port DC_GND_B
DC_GND_Beagle_Board: J18.1 ; port DC_GND_Beagle_Board
DC_GND_CC: J20.1 ; port DC_GND_CC
DC_GND_HMI: J20.2 ; port DC_GND_HMI
DC_GND_Smoke: J20.1 ; port DC_GND_Smoke
DC_GND_Wave: J18.1 ; port DC_GND_Wave
N: J19.0 ; port N
Pre-Charge control PWR: F74.2 ; port Pre-Charge control PWR
NetF73_1: F73.1 J19.5
NetF74_1: F74.1 J19.4
NetFLNR-020_1: FLNR-020.1 J19.3
NetFLNR-020_2: FLNR-020.2 ; sheet GFCI Service Outlet/120V_AC
NetJ18_0: J18.0 ; sheet 24 volt rectifier PN ABE1200-1T24/DC_GND_2
NetJ18_0: J18.0 ; sheet 24 volt rectifier PN ABE1200-1T24/DC_GND_1  [a separate net that carries the same name]
NetJ18_0: J18.0 ; sheet 24 volt rectifier PN ABE1200-1T24/24V_DC_2  [a separate net that carries the same name]
NetJ18_0: J18.0 ; sheet 24 volt rectifier PN ABE1200-1T24/24V_DC_1  [a separate net that carries the same name]
NetJ19_1: J19.1 ; sheet 24 volt rectifier PN ABE1200-1T24/N
NetJ19_1: J19.1 ; sheet 24 volt rectifier PN ABE1200-1T24/120V_AC  [a separate net that carries the same name]
NetJ19_1: J19.1 ; sheet 24 volt rectifier PN ABE1200-1T24/N  [a separate net that carries the same name]
NetJ19_2: J19.2 ; sheet GFCI Service Outlet/N
NetJ19_5: J19.5 ; sheet 24 volt rectifier PN ABE1200-1T24/120V_AC
NetJ20_0: J20.0 ; sheet 24 volt rectifier PN ABE1200-1T24/DC_GND_2
NetJ20_0: J20.0 ; sheet 24 volt rectifier PN ABE1200-1T24/DC_GND_1  [a separate net that carries the same name]
NetJ20_0: J20.0 ; sheet 24 volt rectifier PN ABE1200-1T24/24V_DC_2  [a separate net that carries the same name]
NetJ20_0: J20.0 ; sheet 24 volt rectifier PN ABE1200-1T24/24V_DC_1  [a separate net that carries the same name]
(unnamed): sheet 24 volt rectifier PN ABE1200-1T24/I-SHARE, sheet 24 volt rectifier PN ABE1200-1T24/I-SHARE
(unnamed): sheet GFCI Service Outlet/120V_AC_Load, sheet Service Outlet/120V_AC
(unnamed): sheet GFCI Service Outlet/N_Load, sheet Service Outlet/N

### Notes on the sheet
- Fuse and fuseholder do not match up. Figure out which are correct.
- (near F73) Fuse holder: CH30J2
- (near F73) 14 AWG
- (near F74) Fuse holder: CH30J2
- 14 AWG
- 10 AWG
- (near J18) 18 AWG
- (near J18) 10 AWG
- (near J18) 14 AWG
- (near J19) 10 AWG
- (near J19) 120 V
- N
- Molex 501876-1640
- Must connect: I-SHARE (pin 3)
  Cannot connect: +5Vsb (pin 4)
- (near J20) 18 AWG
- (near J20) 10 AWG
- (near J20) 14 AWG
- (near FLNR-020) 14 AWG
- (near FLNR-020) Fuse holder: 20316R
- PN GF5362SGW
- Legend
- Optical Fiber Connection
- Shielded Ethernet Connection
- Standard Electrical Connection
- Coolant tubing
- Project:
- Engineer:
- Document:
- Approved By:
- Date:
- Revision:
- File:
- Sheet
- of

### Library data of the parts
F73 F74 FLNR-020 = Fuse 2: Fuse; Published: 8-Jun-2000; LatestRevisionDate: 17-Jul-2002; LatestRevisionNote: Re-released for DXP Platform.; PackageReference: PIN-W2/E2.8; Publisher: Altium Limited; PackageDescription: Thru-Hole; 2 Leads
J19 = 2_to_12

## Sheet Relay_Circuit.SchDoc: <Document>
size Letter; Engineer: <Engineer>; Organization: UPEL; Address1: USU Power Electronics Lab; Address2: USTAR Building 620, RM 118; Address3: 1600 N 620 E; Address4: North Logan, UT 84341; DocumentNumber: 2; Revision: v1; SheetNumber: 2; SheetTotal: 16; ProjectName: <Project>
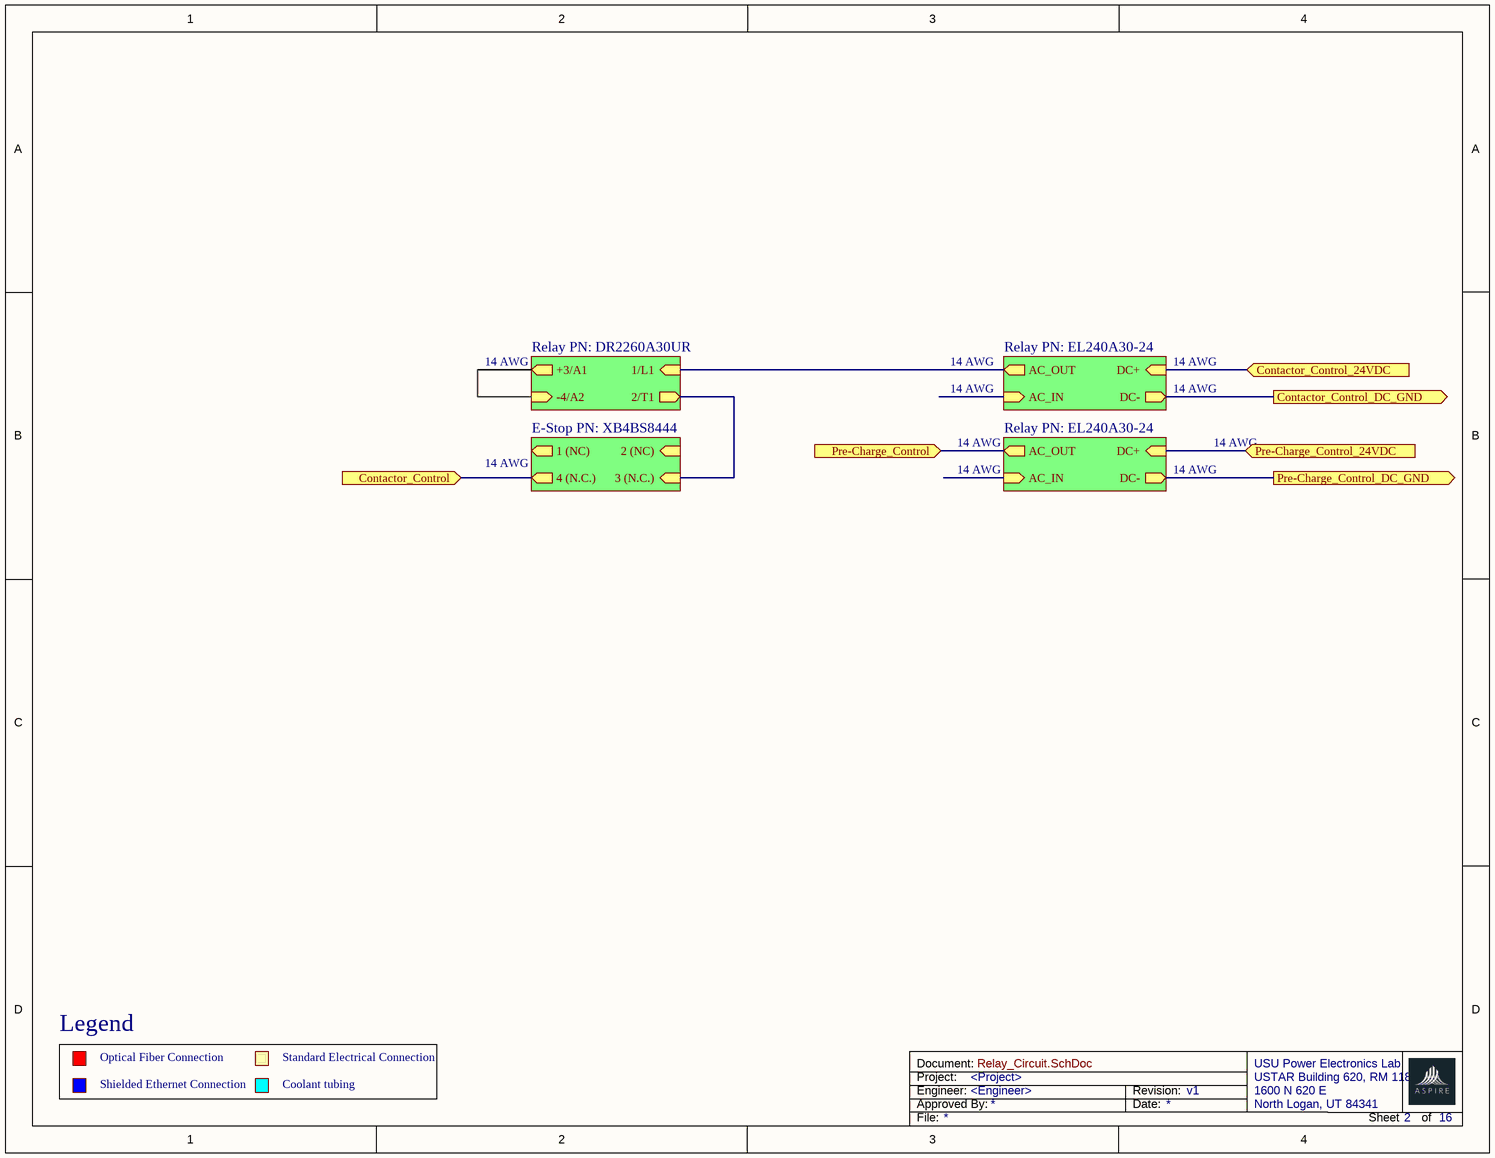
[diagram p13: Relay_Circuit.SchDoc]

### Sub-sheets
E-Stop PN: XB4BS8444 = File Name (file not in this document): 4 (N.C.) (out), 3 (N.C.) (in), 1 (NC) (out), 2 (NC) (in)
Relay PN: DR2260A30UR = File Name (file not in this document): -4/A2 (in), +3/A1 (out), 1/L1 (in), 2/T1 (out)
Relay PN: EL240A30-24 = File Name (file not in this document): AC_IN (in), AC_OUT (out), DC+ (in), DC- (out)
Relay PN: EL240A30-24 = File Name (file not in this document): AC_IN (in), AC_OUT (out), DC+ (in), DC- (out)

### Ports
Contactor_Control (in), Contactor_Control_24VDC (in), Contactor_Control_DC_GND (out), Pre-Charge_Control (in), Pre-Charge_Control_24VDC (in), Pre-Charge_Control_DC_GND (out)

### Nets
Contactor_Control: port Contactor_Control, sheet E-Stop PN: XB4BS8444/4 (N.C.)
Pre-Charge_Control: port Pre-Charge_Control, sheet Relay PN: EL240A30-24/AC_OUT
Contactor_Control_24VDC: port Contactor_Control_24VDC, sheet Relay PN: EL240A30-24/DC+
Contactor_Control_DC_GND: port Contactor_Control_DC_GND, sheet Relay PN: EL240A30-24/DC-
Pre-Charge_Control_24VDC: port Pre-Charge_Control_24VDC, sheet Relay PN: EL240A30-24/DC+
Pre-Charge_Control_DC_GND: port Pre-Charge_Control_DC_GND, sheet Relay PN: EL240A30-24/DC-
(unnamed): sheet Relay PN: EL240A30-24/AC_OUT, sheet Relay PN: DR2260A30UR/1/L1
(unnamed): sheet E-Stop PN: XB4BS8444/3 (N.C.), sheet Relay PN: DR2260A30UR/2/T1
(unnamed): sheet Relay PN: DR2260A30UR/-4/A2, sheet Relay PN: DR2260A30UR/+3/A1

### Notes on the sheet
- 14 AWG
- Legend
- Optical Fiber Connection
- Shielded Ethernet Connection
- Standard Electrical Connection
- Coolant tubing
- Project:
- Engineer:
- Document:
- Approved By:
- Date:
- Revision:
- File:
- Sheet
- of

## Sheet Vehicle_Charger_Hierarchal.SchDoc: <Document>
size Letter; Engineer: <Engineer>; Organization: UPEL; Address1: USU Power Electronics Lab; Address2: USTAR Building 620, RM 118; Address3: 1600 N 620 E; Address4: North Logan, UT 84341; DocumentNumber: 12; Revision: v1; SheetNumber: 12; SheetTotal: 16; ProjectName: <Project>
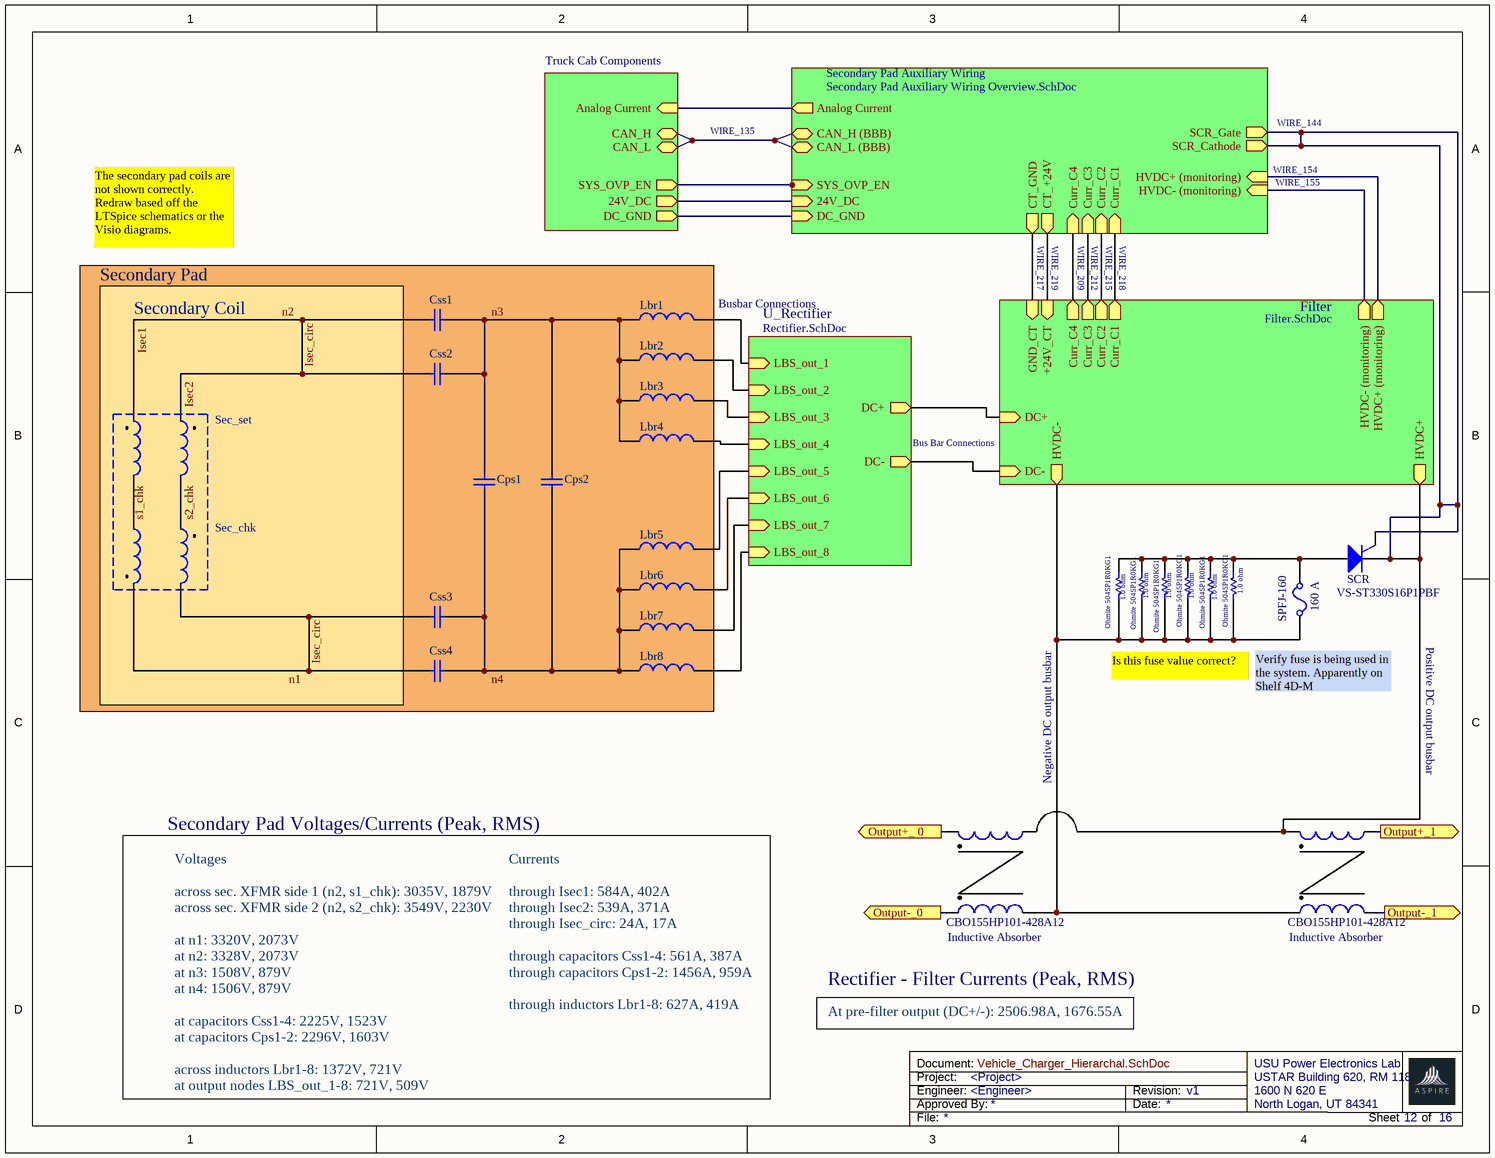
[diagram p14: Vehicle_Charger_Hierarchal.SchDoc]

### Parts
(Parts that share a designator on the sheet are numbered #1, #2 ... from top to bottom, then left to right.)
*?#1  CBO155HP101-428A12  (value not drawn)
*?#2  CBO155HP101-428A12  (value not drawn)
*?#3  CBO155HP101-428A12
*?#4  CBO155HP101-428A12
Cps1  Capacitor  (value not drawn)
Cps2  Capacitor  (value not drawn)
Css1  Capacitor  (value not drawn)
Css2  Capacitor  (value not drawn)
Css3  Capacitor  (value not drawn)
Css4  Capacitor  (value not drawn)
L?#7  Inductor  (value not drawn)
L?#8  Inductor  (value not drawn)
L?#9  Inductor  (value not drawn)
L?#10  Inductor  (value not drawn)
Lbr1  Inductor  (value not drawn)
Lbr2  Inductor  (value not drawn)
Lbr3  Inductor  (value not drawn)
Lbr4  Inductor  (value not drawn)
Lbr5  Inductor  (value not drawn)
Lbr6  Inductor  (value not drawn)
Lbr7  Inductor  (value not drawn)
Lbr8  Inductor  (value not drawn)
Ohmite_504SP1R0KG1#1  value 1.0 ohm  (hidden comment: Resistor)
Ohmite_504SP1R0KG1#2  value 1.0 ohm  (hidden comment: Resistor)
Ohmite_504SP1R0KG1#3  value 1.0 ohm  (hidden comment: Resistor)
Ohmite_504SP1R0KG1#4  value 1.0 ohm  (hidden comment: Resistor)
Ohmite_504SP1R0KG1#5  value 1.0 ohm  (hidden comment: Resistor)
Ohmite_504SP1R0KG1#6  value 1.0 ohm  (hidden comment: Resistor)
SCR  SCR Thyristror  (value not drawn)
SPFJ-160  CURRENT: 160 A  (hidden comment: Fuse)

### Sub-sheets
Filter = Filter.SchDoc: HVDC+ (out), HVDC- (out), DC- (in), DC+ (in), Curr_C1 (out), Curr_C2 (out), Curr_C3 (out), Curr_C4 (out), +24V_CT (in), GND_CT (in), HVDC- (monitoring) (out), HVDC+ (monitoring) (out)
Secondary Pad Auxiliary Wiring = Secondary Pad Auxiliary Wiring Overview.SchDoc (file not in this document): Curr_C1 (in), Curr_C2 (in), Curr_C3 (in), Curr_C4 (in), CAN_L (BBB) (bidir), CAN_H (BBB) (bidir), HVDC- (monitoring) (in), HVDC+ (monitoring) (in), CT_+24V (out), CT_GND (out), SCR_Cathode (out), SCR_Gate (out), SYS_OVP_EN (in), Analog Current (out), 24V_DC (in), DC_GND (in)
Truck Cab Components = File Name (file not in this document): Analog Current (in), 24V_DC (out), DC_GND (out), SYS_OVP_EN (out), CAN_L (bidir), CAN_H (bidir)
U_Rectifier = Rectifier.SchDoc: DC+ (out), DC- (out), LBS_out_1 (in), LBS_out_2 (in), LBS_out_3 (in), LBS_out_4 (in), LBS_out_5 (in), LBS_out_6 (in), LBS_out_7 (in), LBS_out_8 (in)

### Ports
Output+_1 (out), Output+_ 0 (out), Output-_0 (out), Output-_1 (out)

### Nets
+24V_CT: sheet Filter/+24V_CT, sheet Secondary Pad Auxiliary Wiring/CT_+24V
Curr_C1: sheet Filter/Curr_C1, sheet Secondary Pad Auxiliary Wiring/Curr_C1
Curr_C2: sheet Filter/Curr_C2, sheet Secondary Pad Auxiliary Wiring/Curr_C2
Curr_C3: sheet Filter/Curr_C3, sheet Secondary Pad Auxiliary Wiring/Curr_C3
Curr_C4: sheet Filter/Curr_C4, sheet Secondary Pad Auxiliary Wiring/Curr_C4
DC+: sheet Filter/DC+, sheet U_Rectifier/DC+
DC-: sheet Filter/DC-, sheet U_Rectifier/DC-
GND_CT: sheet Filter/GND_CT, sheet Secondary Pad Auxiliary Wiring/CT_GND
HVDC+: SCR.2(K) SCR.3 ; sheet Filter/HVDC+, sheet Filter/HVDC+ (monitoring), sheet Secondary Pad Auxiliary Wiring/HVDC+ (monitoring), sheet Secondary Pad Auxiliary Wiring/SCR_Cathode, sheet Secondary Pad Auxiliary Wiring/SCR_Gate
HVDC-: Ohmite_504SP1R0KG1#1.1 Ohmite_504SP1R0KG1#2.1 Ohmite_504SP1R0KG1#3.1 Ohmite_504SP1R0KG1#4.1 Ohmite_504SP1R0KG1#5.1 Ohmite_504SP1R0KG1#6.1 SPFJ-160.1 ; sheet Filter/HVDC-, sheet Filter/HVDC- (monitoring), sheet Secondary Pad Auxiliary Wiring/HVDC- (monitoring)
Isec1: Css1.1 Css2.1 L?#7.2 L?#8.2  [also labelled Isec2, n2]
LBS_out_1: Lbr1.2 ; sheet U_Rectifier/LBS_out_1
LBS_out_2: Lbr2.2 ; sheet U_Rectifier/LBS_out_2
LBS_out_3: Lbr3.2 ; sheet U_Rectifier/LBS_out_3
LBS_out_4: Lbr4.2 ; sheet U_Rectifier/LBS_out_4
LBS_out_5: Lbr5.2 ; sheet U_Rectifier/LBS_out_5
LBS_out_6: Lbr6.2 ; sheet U_Rectifier/LBS_out_6
LBS_out_7: Lbr7.2 ; sheet U_Rectifier/LBS_out_7
LBS_out_8: Lbr8.2 ; sheet U_Rectifier/LBS_out_8
n1: Css3.1 Css4.1 L?#9.2 L?#10.1
n3: Cps1.2 Cps2.2 Css1.2 Css2.2 Lbr1.1 Lbr2.1 Lbr3.1 Lbr4.1
n4: Cps1.1 Cps2.1 Css3.2 Css4.2 Lbr5.1 Lbr6.1 Lbr7.1 Lbr8.1
s2_chk: L?#8.1 L?#10.2
NetL?#7_1: L?#7.1 L?#9.1
NetOhmite_504SP1R0KG1#1_2: Ohmite_504SP1R0KG1#1.2 Ohmite_504SP1R0KG1#2.2 Ohmite_504SP1R0KG1#3.2 Ohmite_504SP1R0KG1#4.2 Ohmite_504SP1R0KG1#5.2 Ohmite_504SP1R0KG1#6.2 SCR.1(A) SPFJ-160.2
(unnamed): sheet Secondary Pad Auxiliary Wiring/CAN_L (BBB), sheet Secondary Pad Auxiliary Wiring/CAN_H (BBB), sheet Truck Cab Components/CAN_L, sheet Truck Cab Components/CAN_H
(unnamed): sheet Secondary Pad Auxiliary Wiring/SYS_OVP_EN, sheet Truck Cab Components/SYS_OVP_EN
(unnamed): sheet Secondary Pad Auxiliary Wiring/Analog Current, sheet Truck Cab Components/Analog Current
(unnamed): sheet Secondary Pad Auxiliary Wiring/24V_DC, sheet Truck Cab Components/24V_DC
(unnamed): sheet Secondary Pad Auxiliary Wiring/DC_GND, sheet Truck Cab Components/DC_GND

Not connected (* = marked no-connect by the designer): *?#1 9 10; *?#2 9 10; *?#3 9 10; *?#4 9 10

### Notes on the sheet
- WIRE_135
- WIRE_144
- WIRE_154
- WIRE_155
- The secondary pad coils are not shown correctly. Redraw based off the LTSpice schematics or the Visio diagrams.
- Secondary Pad
- WIRE_217
- WIRE_219
- WIRE_209
- WIRE_212
- WIRE_215
- WIRE_218
- Secondary Coil
- (near Lbr1) Busbar Connections
- (near L?#8) Sec_set
- Bus Bar Connections
- (near L?#10) Sec_chk
- VS-ST330S16P1PBF
- Positive DC output busbar
- (near Ohmite_504SP1R0KG1#1) Is this fuse value correct?
- Verify fuse is being used in the system. Apparently on Shelf 4D-M
- Secondary Pad Voltages/Currents (Peak, RMS)
- Negative DC output busbar
- (near *?#3) Inductive Absorber
- (near *?#4) Inductive Absorber
- Currents
  through Isec1: 584A, 402A
  through Isec2: 539A, 371A
  through Isec_circ: 24A, 17A
  through capacitors Css1-4: 561A, 387A
  through capacitors Cps1-2: 1456A, 959A
  through inductors Lbr1-8: 627A, 419A
- At pre-filter output (DC+/-): 2506.98A, 1676.55A
- Rectifier - Filter Currents (Peak, RMS)
- Voltages
  across sec. XFMR side 1 (n2, s1_chk): 3035V, 1879V
  across sec. XFMR side 2 (n2, s2_chk): 3549V, 2230V
  at n1: 3320V, 2073V
  at n2: 3328V, 2073V
  at n3: 1508V, 879V
  at n4: 1506V, 879V
  at capacitors Css1-4: 2225V, 1523V
  at capacitors Cps1-2: 2296V, 1603V
  across inductors Lbr1-8: 1372V, 721V
  at output nodes LBS_out_1-8: 721V, 509V
- Labels drawn without touching a wire or pin: Isec_circ, s1_chk
- Project:
- Engineer:
- Document:
- Approved By:
- Date:
- Revision:
- File:
- Sheet
- of

### Library data of the parts
*?#1-*?#4 = CMP-006-000013-3: 59.6 uH Common Mode Inductor with coupling of 0.9996
Cps1 Cps2 = Capacitor: SimulationGenericComponent: True; Value: 1.128uF
Css1 = Capacitor: SimulationGenericComponent: True; Value: 500.02nF
Css2 = Capacitor: SimulationGenericComponent: True; Value: 499.16nF
Css3 = Capacitor: SimulationGenericComponent: True; Value: 499.07nF
Css4 = Capacitor: SimulationGenericComponent: True; Value: 499.73nF
L?#7-L?#10 = Inductor: SimulationGenericComponent: True; Value: 1u
Lbr1-Lbr8 = Inductor: SimulationGenericComponent: True; Value: 3.126uF
Ohmite_504SP1R0KG1#1-Ohmite_504SP1R0KG1#6 = Resistor: TC1: 0; SimulationGenericComponent: True; TC2: 0
SCR = SCR: IH: 50MA; IGT: 40MA; TON: 1US; VTMIN: 1V; VDRM: 50V; DVDT: 50MEG; TQ: 20US; K1: 1; SimulationGenericComponent: True; K2: 1
SPFJ-160 = Fuse: RESISTANCE: 1m; SimulationGenericComponent: True